# EAGLE design StraightThumbs (EAGLE 9.1.1)
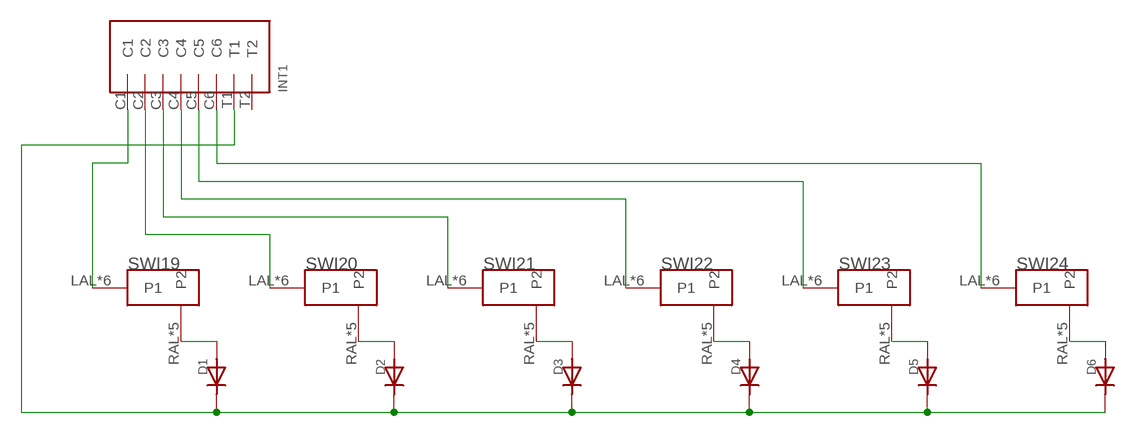
[diagram p0: schematic, sheet 1]

## Parts
D1  DIODE  [DIODE_COMBO]
D2  DIODE  [DIODE_COMBO]
D3  DIODE  [DIODE_COMBO]
D4  DIODE  [DIODE_COMBO]
D5  DIODE  [DIODE_COMBO]
D6  DIODE  [DIODE_COMBO]
INT1  INTRCNNT4X2  [INTRRIBBON]
SWI19  MX/ALPSDOUBLESIDED  [DOUBLED_MX/ALPS]
SWI20  MX/ALPSDOUBLESIDED  [DOUBLED_MX/ALPS]
SWI21  MX/ALPSDOUBLESIDED  [DOUBLED_MX/ALPS]
SWI22  MX/ALPSDOUBLESIDED  [DOUBLED_MX/ALPS]
SWI23  MX/ALPSDOUBLESIDED  [DOUBLED_MX/ALPS]
SWI24  MX/ALPSDOUBLESIDED  [DOUBLED_MX/ALPS]

## Nets
N$1: D1.ANOSB(AN) D1.ANOST(AN) D1.ANOT(AN) SWI19.RAL(P2) SWI19.RAR(P2) SWI19.RCL(P2) SWI19.RCR(P2) SWI19.RLMID(P2)
N$2: D2.ANOSB(AN) D2.ANOST(AN) D2.ANOT(AN) SWI20.RAL(P2) SWI20.RAR(P2) SWI20.RCL(P2) SWI20.RCR(P2) SWI20.RLMID(P2)
N$3: D3.ANOSB(AN) D3.ANOST(AN) D3.ANOT(AN) SWI21.RAL(P2) SWI21.RAR(P2) SWI21.RCL(P2) SWI21.RCR(P2) SWI21.RLMID(P2)
N$4: D4.ANOSB(AN) D4.ANOST(AN) D4.ANOT(AN) SWI22.RAL(P2) SWI22.RAR(P2) SWI22.RCL(P2) SWI22.RCR(P2) SWI22.RLMID(P2)
N$5: D5.ANOSB(AN) D5.ANOST(AN) D5.ANOT(AN) SWI23.RAL(P2) SWI23.RAR(P2) SWI23.RCL(P2) SWI23.RCR(P2) SWI23.RLMID(P2)
N$6: D6.ANOSB(AN) D6.ANOST(AN) D6.ANOT(AN) SWI24.RAL(P2) SWI24.RAR(P2) SWI24.RCL(P2) SWI24.RCR(P2) SWI24.RLMID(P2)
N$7: INT1.C1 SWI19.LAL(P1) SWI19.LAR(P1) SWI19.LCL(P1) SWI19.LCR(P1) SWI19.LLP(P1) SWI19.LRLP(P1)
N$8: INT1.C2 SWI20.LAL(P1) SWI20.LAR(P1) SWI20.LCL(P1) SWI20.LCR(P1) SWI20.LLP(P1) SWI20.LRLP(P1)
N$9: INT1.C3 SWI21.LAL(P1) SWI21.LAR(P1) SWI21.LCL(P1) SWI21.LCR(P1) SWI21.LLP(P1) SWI21.LRLP(P1)
N$10: INT1.C4 SWI22.LAL(P1) SWI22.LAR(P1) SWI22.LCL(P1) SWI22.LCR(P1) SWI22.LLP(P1) SWI22.LRLP(P1)
N$11: INT1.C5 SWI23.LAL(P1) SWI23.LAR(P1) SWI23.LCL(P1) SWI23.LCR(P1) SWI23.LLP(P1) SWI23.LRLP(P1)
N$12: INT1.C6 SWI24.LAL(P1) SWI24.LAR(P1) SWI24.LCL(P1) SWI24.LCR(P1) SWI24.LLP(P1) SWI24.LRLP(P1)
N$13: D1.CATSB(CAT) D1.CATST(CAT) D1.CATT(CAT) D2.CATSB(CAT) D2.CATST(CAT) D2.CATT(CAT) D3.CATSB(CAT) D3.CATST(CAT) D3.CATT(CAT) D4.CATSB(CAT) D4.CATST(CAT) D4.CATT(CAT) D5.CATSB(CAT) D5.CATST(CAT) D5.CATT(CAT) D6.CATSB(CAT) D6.CATST(CAT) D6.CATT(CAT) INT1.T1
Unconnected: INT1.T2

## Library data of the parts
D1-D6 = Keys:DIODE
INT1 = Keys:INTRCNNT
SWI19-SWI24 = Keys:MX/ALPS

## Board
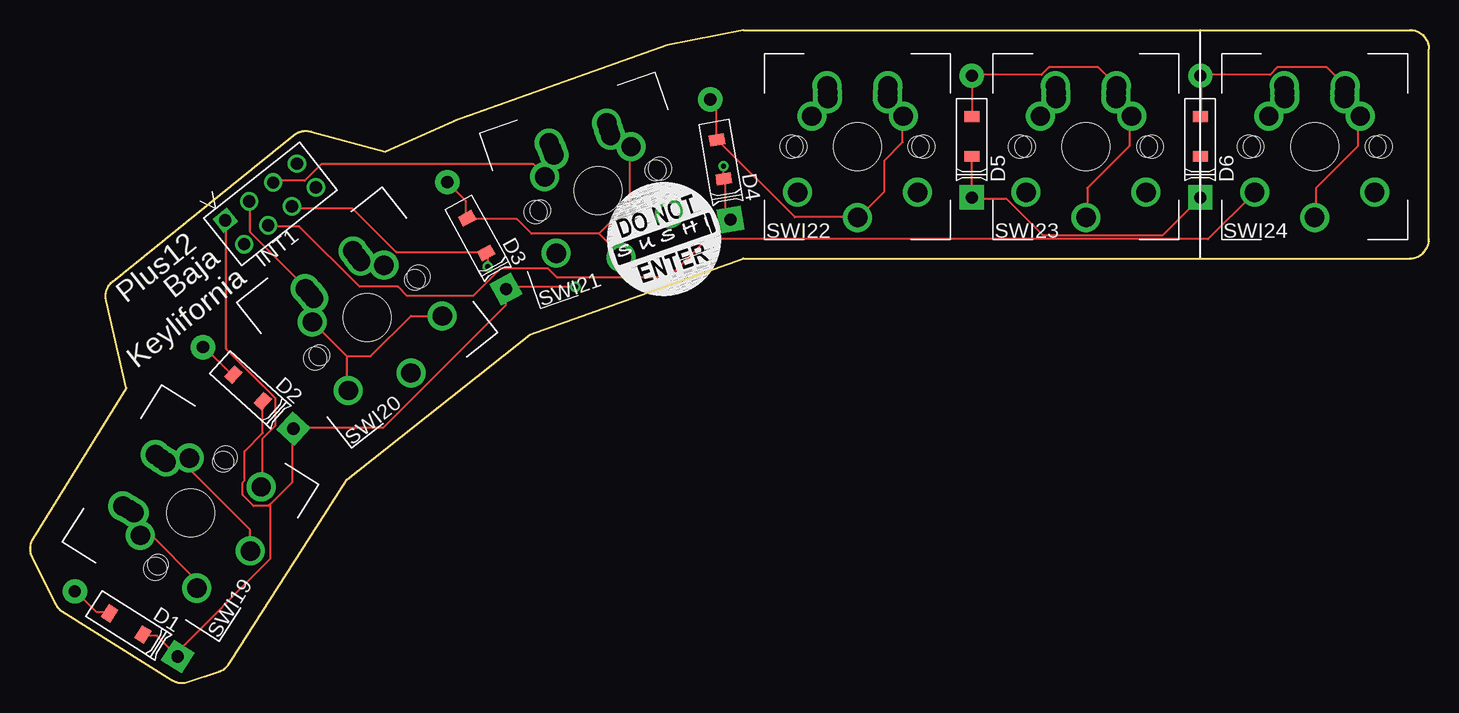
[diagram p1: board, top side]
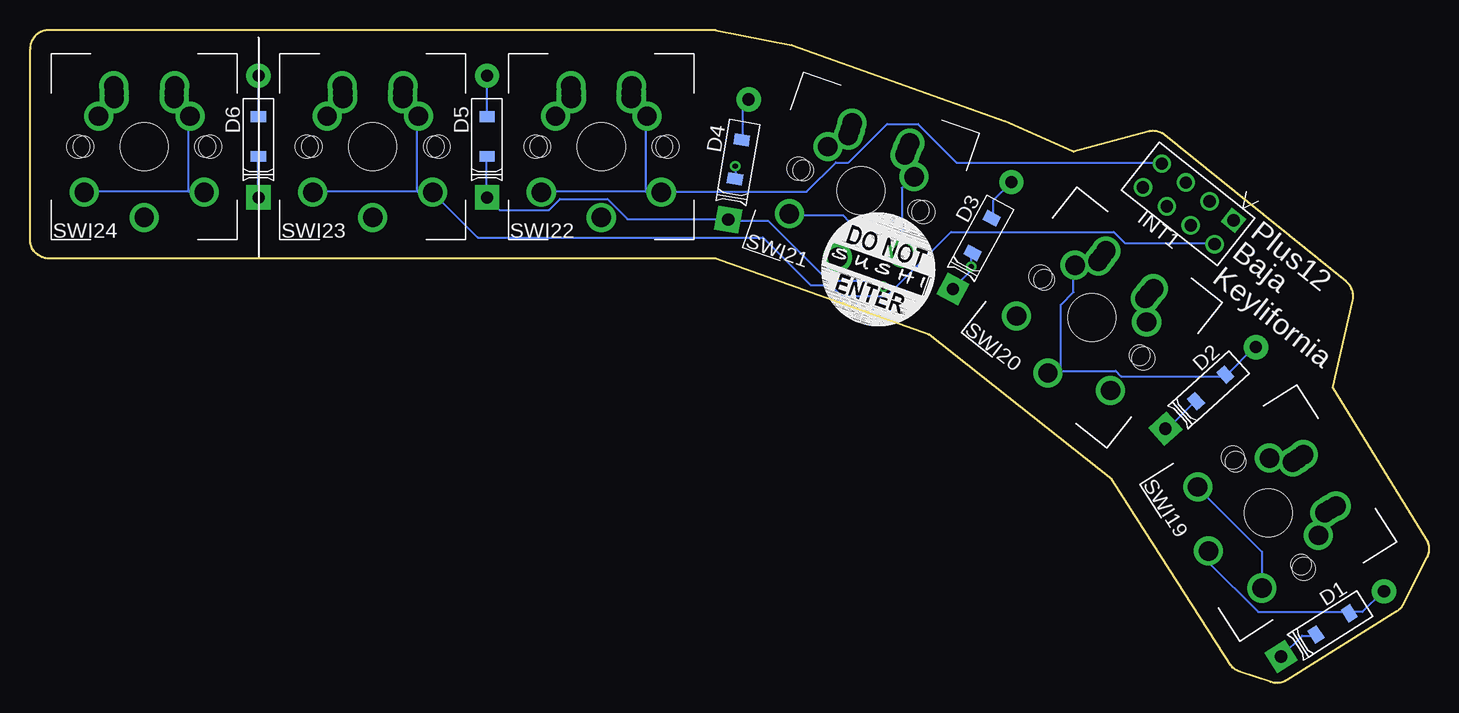
[diagram p2: board, bottom side, seen from below]

Size 116.61 x 54.45 mm. Coordinates in mm from the lower left corner, seen from the top.
Outline: 59.46,54.45 115.02,54.45 arc-90 116.61,52.87 116.61,36.99 arc-90 115.02,35.4 59.46,35.4 41.68,29.05 26.44,16.99 16.58,1.59 arc-39 15.75,0.94 13.18,0.08 arc-50 11.84,0.24 2.69,5.96 arc-31 2.11,6.59 0.17,10.48 arc-58 0.24,12.03 8.03,24.61 6.34,31.9 arc-64 6.89,33.49 22,45.69 arc-54 23.41,45.99 29.62,44.29 35.33,46.83 53.11,53.18 59.46,54.45
Copper layers (1*16): Top 0.035mm / dielectric 1.5mm / Bottom 0.035mm
Design rules "Sierra": minimum track width 6mil, minimum drill 0.45mm, track to track 6mil, track to pad 6mil, pad to pad 6mil, via to via 6mil, smd to smd 6mil, copper to edge 0.4mm, drill to drill 10mil, minimum pad ring 10mil, minimum via ring 8mil, stop-mask expansion 4mil, vias tented up to drill 0mil, thermal gap 10mil

### Footprints (pad centres in the part's own frame; a part is rotated, then mirrored left to right if it is on the bottom)
DIODE_COMBO = smd 0.914 x 1.27 bottom: ANOSB 1.651,0; CATSB -1.651,0 | smd 0.914 x 1.27: ANOST 1.651,0; CATST -1.651,0 | drill 1.016 pad 2.032: ANOT 5.08,0 | drill 1.016 pad 2.032 square: CATT -5.08,0
INTRRIBBON = drill 1.016 square: C1 0,0 | drill 1.016: C2 2.54,0; C3 5.08,0; C4 7.62,0; C5 0,-2.54; C6 2.54,-2.54; T1 5.08,-2.54; T2 7.62,-2.54
DOUBLED_MX/ALPS = drill 1.613: LAL -2.5,4; LAR -2.5,4.5; LCL -3.81,2.54; LCR -2.54,5.08; LLP -5,-3.8; LRLP 5,-3.8; RAL 2.5,4; RAR 2.5,4.5; RCL 3.81,2.54; RCR 2.54,5.08; RLMID 0,-5.9 | hole 3.988: 0,0 | hole 1.702: -5.08,0; 5.08,0 | hole 1.9: -5.5,0; 5.5,0

### Placement (x,y rotation side)
D1  8.03,4.92 147.6 top
D2  18.19,24.61 138 top
D3  37.24,37.31 118.7 top
D4  57.56,43.66 99.6 top
D5  78.51,45.56 90 top
D6  97.56,45.56 90 top
INT1  16.28,38.58 38.4 top
SWI19  13.39,14.17 57.6 top
SWI20  28.09,30.48 38.4 top
SWI21  47.35,41.07 19.2 top
SWI22  68.99,44.73 0 top
SWI23  88.04,44.73 0 top
SWI24  107.09,44.73 0 top
U$1  [3_8INCH_TOP]  49.94,30.96 19.2 top
U$2  [3_8INCH_BOT]  42.95,28.42 19.2 top

### Tracks (layer width: path | path; a pad name or v marks a point on that pad's centre or on a via)
N$1
  Top 0.152: 11.33,18.56 11.02,18.56 SWI19.RAR 11.33,18.56 | 11.33,18.56 SWI19.RCR | 11.33,18.56 SWI19.RAL 11.48,18.56 11.63,18.72 13.16,18.72 SWI19.RCL 13.31,18.72 13.31,17.8 18.34,12.77 18.34,11.1 SWI19.RLMID | D1.ANOST 6.6,5.92 5.54,5.92 3.86,7.59 D1.ANOT
  Bottom 0.152: D1.ANOT 3.86,7.59 5.54,5.92 6.6,5.92 D1.ANOST 6.76,5.92 14.22,5.92 18.34,10.03 18.34,10.94 SWI19.RLMID
N$2
  Top 0.152: SWI20.RAR 27.18,35.63 26.87,35.94 SWI20.RCR | SWI20.RCL 29.46,34.87 27.79,34.87 27.64,35.02 SWI20.RAR | SWI20.RAL 27.48,35.18 SWI20.RAR | D2.ANOST 16.81,25.73 14.53,28.01 D2.ANOT
  Bottom 0.152: D2.ANOT 14.53,28.01 16.81,25.73 D2.ANOST 16.97,25.57 25.65,25.57 26.11,26.03 30.68,26.03 | 30.68,26.03 31.6,26.03 31.75,25.88 SWI20.RLMID 30.68,26.03 | 30.68,26.03 30.68,31.52 29.62,32.59 29.62,34.72 SWI20.RCL
N$3
  Top 0.152: 48.36,45.69 48.36,46 SWI21.RAR | 48.36,45.69 SWI21.RCR | SWI21.RAR 48.51,45.54 49.28,44.78 50.04,44.78 SWI21.RCL 50.04,44.62 50.04,40.05 47.45,37.46 | 48.36,45.69 SWI21.RAL | 48.36,45.69 SWI21.RAR | D3.ANOT 34.8,41.73 36.32,40.21 36.32,38.83 D3.ANOST 36.47,38.68 40.59,38.68 41.81,37.46 47.45,37.46 | 47.45,37.46 49.28,35.63 SWI21.RLMID
  Bottom 0.152: D3.ANOST 36.32,38.83 36.32,40.21 34.8,41.73 D3.ANOT
N$4
  Top 0.152: SWI22.RAL 71.53,48.74 71.53,49.2 SWI22.RAR | SWI22.RAL 71.53,48.59 72.75,47.37 SWI22.RCL 72.75,47.22 72.75,45.08 71.22,43.56 71.22,40.97 69.09,38.83 SWI22.RLMID 68.94,38.83 63.75,38.83 57.35,45.23 D4.ANOST 57.2,45.39 57.2,48.13 56.74,48.59 D4.ANOT | SWI22.RCR 71.53,49.35 SWI22.RAL
  Bottom 0.152: D4.ANOST 57.2,45.39 57.2,48.13 56.74,48.59 D4.ANOT
N$5
  Top 0.152: SWI23.RLMID 88.14,38.83 88.14,41.27 91.64,44.78 91.64,47.06 91.8,47.22 SWI23.RCL 91.8,47.37 90.58,48.59 SWI23.RAR | D5.ANOST 78.54,47.22 78.54,50.57 D5.ANOT 78.54,50.72 84.33,50.72 84.94,51.33 89.05,51.33 SWI23.RCR | SWI23.RCR SWI23.RAL 90.58,49.2 SWI23.RAR | SWI23.RCR SWI23.RAR
  Bottom 0.152: D5.ANOST 78.54,47.22 78.54,50.57 D5.ANOT
N$6
  Top 0.152: SWI24.RLMID 107.19,38.83 107.19,41.27 110.69,44.78 110.69,47.06 110.85,47.22 SWI24.RCL 110.85,47.37 109.63,48.59 SWI24.RAR | D6.ANOST 97.59,47.22 97.59,50.57 D6.ANOT 97.59,50.72 103.38,50.72 103.99,51.33 108.1,51.33 SWI24.RCR | SWI24.RCR SWI24.RAL 109.63,49.2 SWI24.RAR | SWI24.RCR SWI24.RAR
  Bottom 0.152: D6.ANOST 97.59,47.22 97.59,50.57 D6.ANOT
N$7
  Top 0.152: 8.28,14.6 8.59,14.3 SWI19.LAL | 8.28,14.6 SWI19.LCR | SWI19.LAL 8.74,14.14 9.19,13.69 SWI19.LCL 9.35,12.16 10.26,12.16 13.77,8.66 13.77,8.05 SWI19.LLP | 8.28,14.6 SWI19.LAR | 8.28,14.6 SWI19.LAL | INT1.C1 16.36,38.53 16.36,27.86 20.47,23.75 20.47,21.46 19.41,20.39 19.41,16.43 SWI19.LRLP
  Bottom 0.152: SWI19.LLP 13.92,8.05 13.92,10.94 19.25,16.28 SWI19.LRLP
N$8
  Top 0.152: 23.06,32.89 18.34,37.61 18.34,40.05 INT1.C2 | 23.06,32.89 SWI20.LAR 23.37,32.43 SWI20.LCR 23.06,32.89 | 26.42,27.25 26.42,24.51 SWI20.LLP | 26.42,27.25 23.67,29.99 SWI20.LCL 23.67,30.15 23.67,31.98 SWI20.LAL 23.06,32.89 | 26.42,27.25 28.4,27.25 31.75,30.6 34.34,30.6 SWI20.LRLP
N$9
  Top 0.152: SWI21.LAR 43.64,44.47 43.64,44.17 SWI21.LAL 43.64,44.62 43.33,44.93 SWI21.LCR 43.64,44.02 42.42,42.8 | 42.42,42.8 42.88,42.34 SWI21.LCL 42.42,42.8 | 42.42,42.8 41.96,43.25 24.28,43.25 22.91,41.88 20.32,41.88 INT1.C3
  Bottom 0.152: 43.94,38.53 43.94,41.27 43.03,42.19 SWI21.LCL | 43.94,38.53 43.94,35.94 SWI21.LLP | 43.94,38.53 48.36,38.53 48.82,38.99 53.24,38.99 SWI21.LRLP
N$10
  Top 0.152: SWI22.LCL 65.28,47.37 66.5,48.59 SWI22.LAR 66.5,49.35 66.5,49.81 SWI22.LCR 66.5,48.74 SWI22.LAL
  Bottom 0.152: INT1.C4 22.3,43.41 39.37,43.41 42.57,46.61 45.16,46.61 48.36,43.41 49.43,43.41 51.87,40.97 63.91,40.97 SWI22.LLP 64.06,40.97 65.28,40.97 | 65.28,40.97 73.96,40.97 SWI22.LRLP | 65.28,40.97 65.28,47.22 SWI22.LCL
N$11
  Top 0.152: SWI23.LCL 84.33,47.37 85.55,48.59 SWI23.LAR 85.55,49.35 85.55,49.81 SWI23.LCR 85.55,48.74 SWI23.LAL
  Bottom 0.152: INT1.C5 17.88,36.7 25.35,36.7 26.26,37.61 39.83,37.61 45.16,32.28 48.97,32.28 49.89,33.19 51.56,33.19 55.52,37.16 79.3,37.16 82.96,40.81 SWI23.LLP 83.11,40.97 84.33,40.97 | 84.33,40.97 93.01,40.97 SWI23.LRLP | 84.33,40.97 84.33,47.22 SWI23.LCL
N$12
  Top 0.152: SWI24.LCL 103.38,47.37 104.6,48.59 SWI24.LAR 104.6,49.35 104.6,49.81 SWI24.LCR SWI24.LAL | INT1.C6 19.86,38.07 22.45,38.07 27.48,33.04 30.68,33.04 31.45,32.28 36.93,32.28 39.22,34.57 43.18,34.57 43.94,33.8 53.24,33.8 56.44,37 98.2,37 102.01,40.81 SWI24.LLP
  Bottom 0.152: 103.38,40.97 102.16,40.97 SWI24.LLP | 103.38,40.97 112.06,40.97 SWI24.LRLP | 103.38,40.97 103.38,47.22 SWI24.LCL
N$13  (via drill 0.45)
  Top 0.152: v57.81,43.1 57.81,42.03 D4.CATST 57.96,41.88 57.96,38.99 58.27,38.68 D4.CATT | D5.CATST 78.54,43.86 78.54,40.51 D5.CATT 78.54,40.36 81.43,40.36 84.48,37.31 94.39,37.31 97.43,40.36 D6.CATT 97.59,40.51 97.59,43.86 D6.CATST | INT1.T1 21.84,39.6 26.87,39.6 30.53,35.94 38,35.94 D3.CATST 38.15,35.79 v38.15,34.72 | 12.09,2.41 12.24,2.26 D1.CATT 12.09,2.41 | 12.09,2.41 10.57,3.93 9.5,3.93 D1.CATST | 20.02,14.91 21.84,16.74 21.84,21.16 D2.CATT 22,21.31 29.46,21.31 39.67,31.52 39.67,32.74 D3.CATT 39.83,32.89 39.98,33.04 v45.47,33.04 | 20.02,14.91 19.86,14.75 18.64,14.75 17.73,15.67 17.73,16.74 17.88,16.89 17.88,19.33 19.41,20.85 19.41,23.44 D2.CATST | 12.09,2.41 20.02,10.33 20.02,14.91
  Bottom 0.152: v57.81,43.1 57.81,42.03 D4.CATST | D5.CATST 78.54,43.86 78.54,40.51 D5.CATT 78.38,40.36 77.47,39.44 73.36,39.44 72.44,40.36 68.48,40.36 66.8,38.68 58.42,38.68 D4.CATT 58.27,38.53 55.07,38.53 50.04,33.5 45.92,33.5 v45.47,33.04 | D6.CATST 97.59,43.86 97.59,40.51 D6.CATT | D3.CATST 38.15,35.79 v38.15,34.72 38.15,34.41 39.67,32.89 D3.CATT | D1.CATST 9.5,3.93 10.57,3.93 12.24,2.26 D1.CATT | D2.CATST 19.56,23.44 21.84,21.16 D2.CATT

### Text on the board
tPlace: Baja / Keylifornia | Plus12
bPlace: Plus12 | Baja / Keylifornia